# EasyEDA schematic SCH_Designing a PCB(1)_2022-05-29.json
TITLE: PWM PCB; REV: 1.0; Date: 2022-05-29; Sheet: 1/1; Company: Deakin university
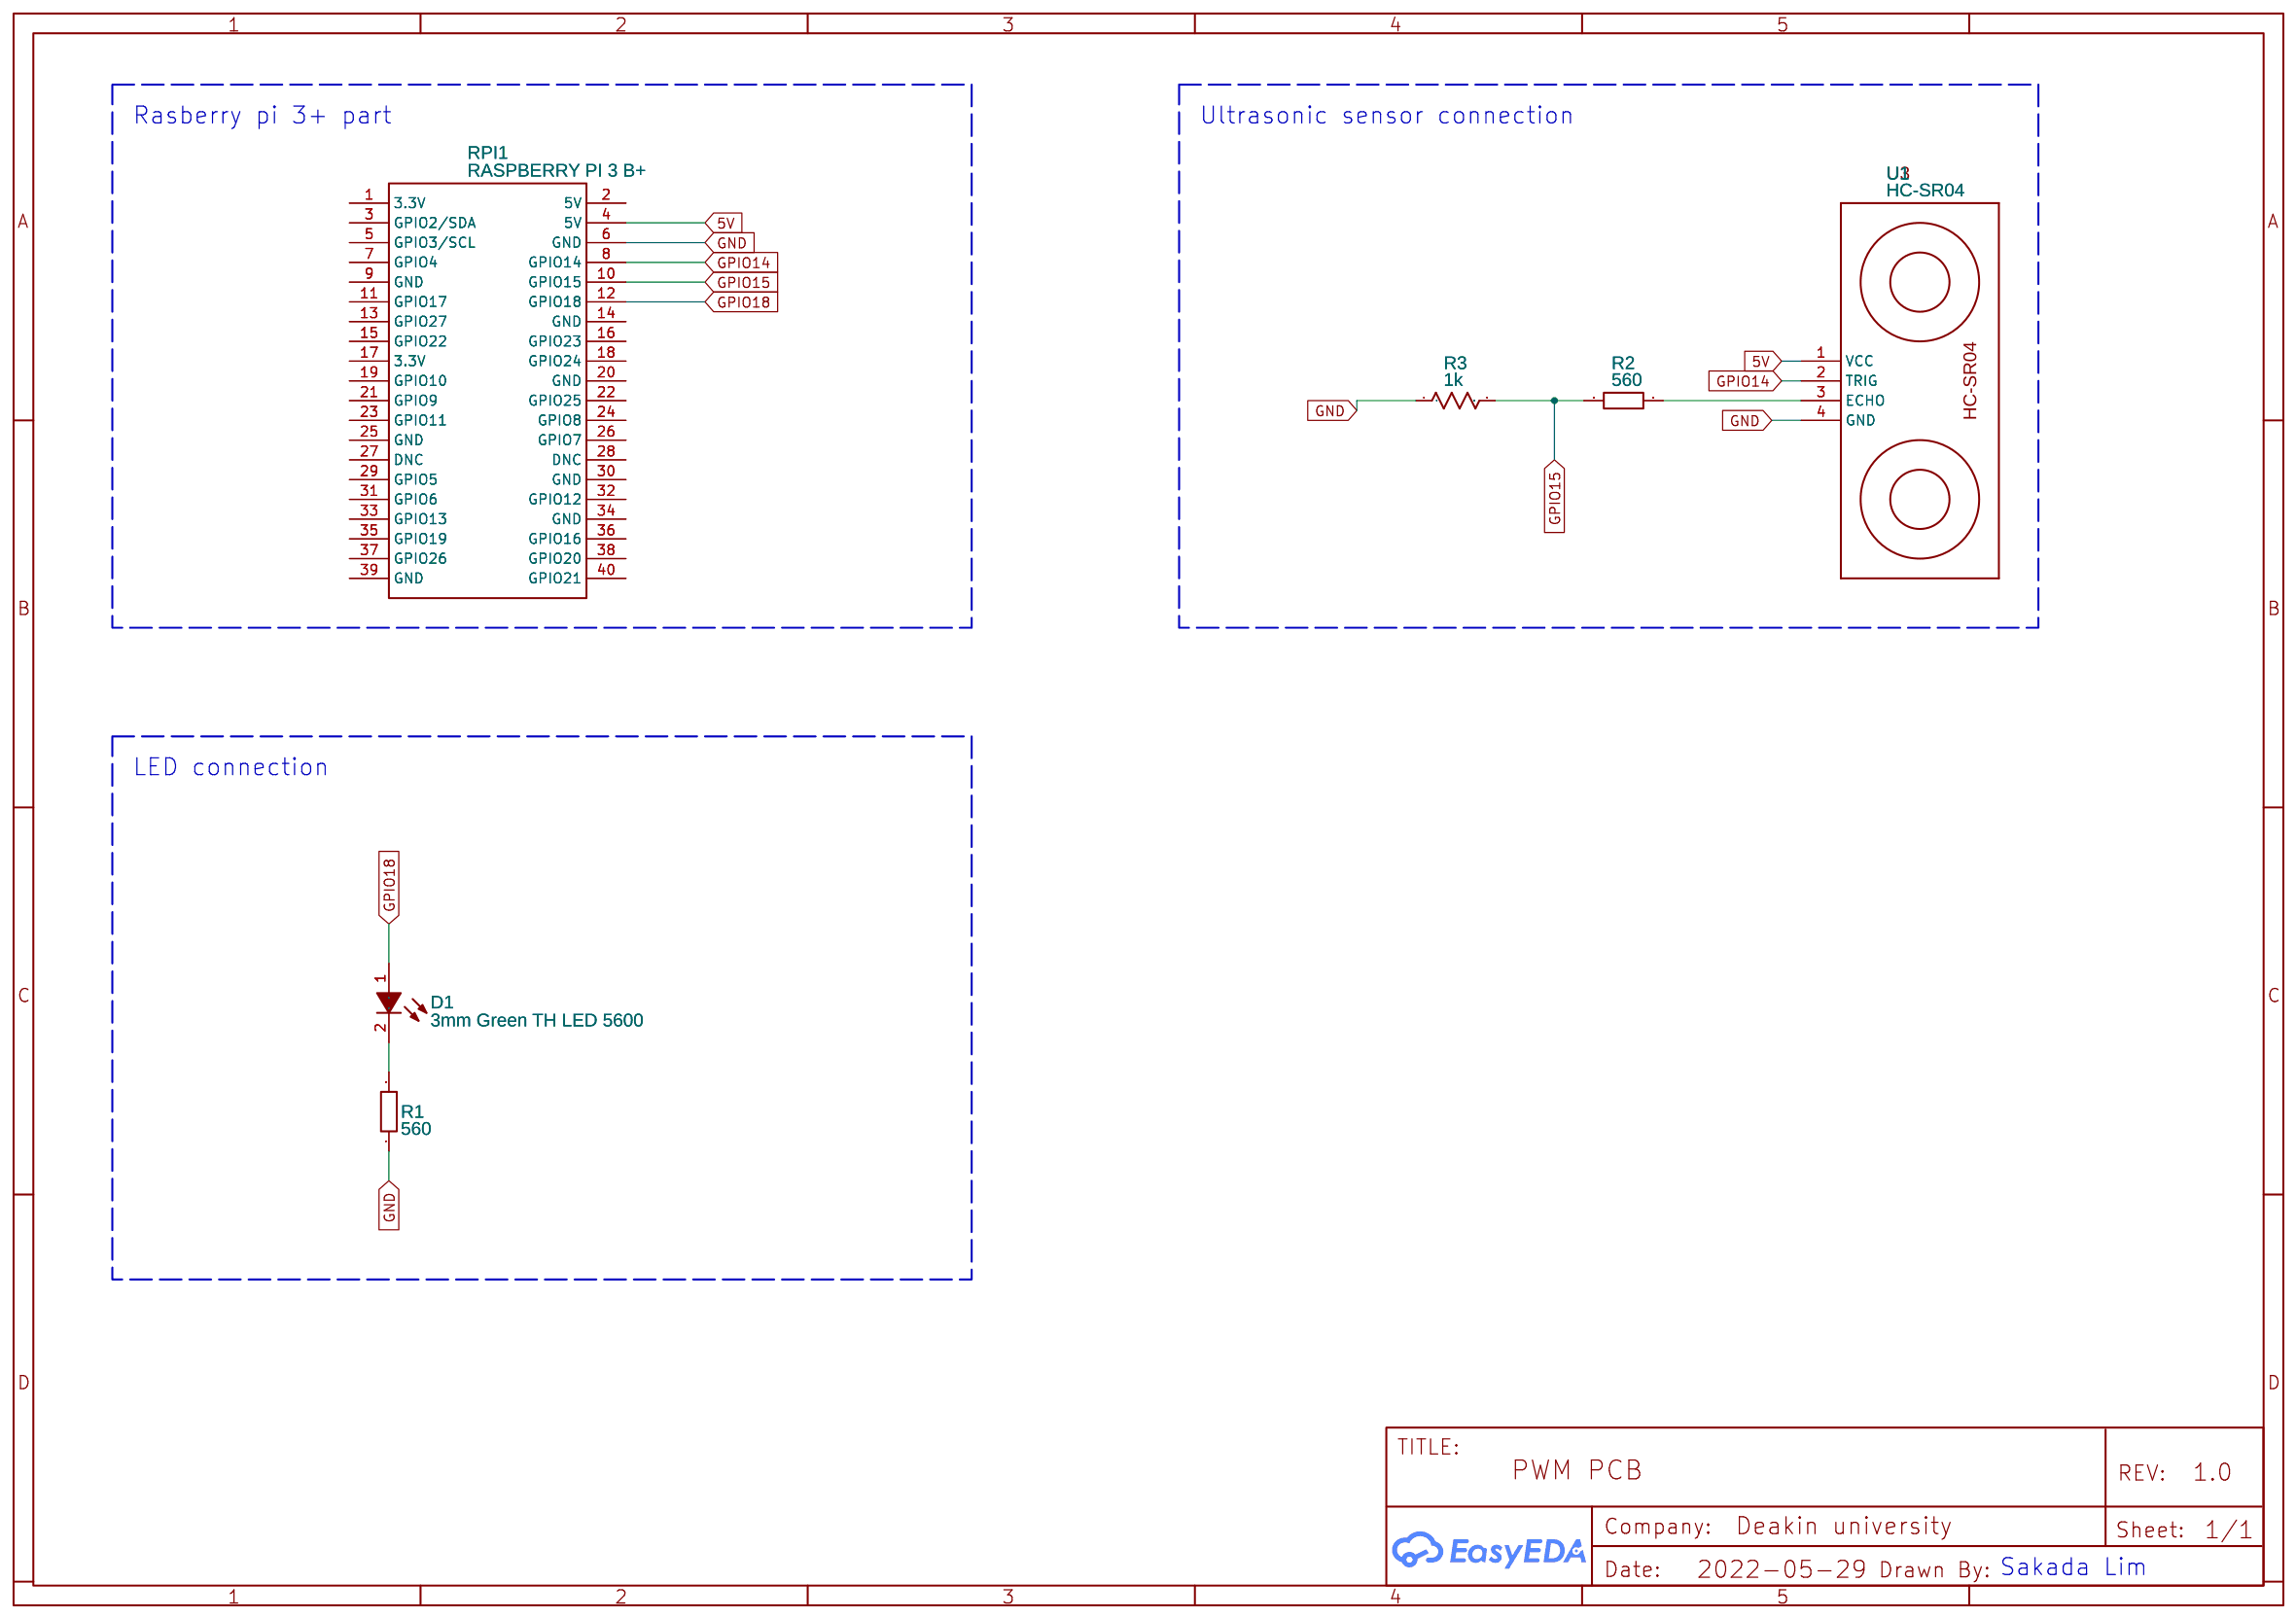
[diagram p0: schematic sheet]

## Parts
D1  3mm Green TH LED 5600  [LED-TH_LED-DP2-2LED]
R1  560  [RESISTOR 1/4 WATT 560 OHM]
R2  560  [RESISTOR 1/4 WATT 560 OHM]
R3  1k  [PKG-0.25W RESISTOR]
RPI1  RASPBERRY PI 3 B+  [HDR-20X2/2.54]
U1  HC-SR04  [HC-SR04]

## Library data of the parts
D1 = 3mm Green TH LED 5600: Supplier: Digi-Key; Manufacturer: VccLite; Manufacturer Part: 5600; Supplier Part: L20325-ND; link: https://vcclite.com/product/5602f5-5v/; Contributor: ATE
R1 R2 = 560: Contributor: Hendriyana
R3 = 1k: Power: 1/4W; Tolerance: ±5%; Supplier Part: 9339051; Supplier: Element14; Manufacturer: MULTICOMP; Manufacturer Part: MCF 0.25W 10K; Link: http://www.farnell.com/datasheets/1716725.pdf?_ga=2.90317594.160514692.1507047083-238689616.1505921947&_gac=1.171691668.1506872032.EAIaIQobChMItau139_P1gIVBZ8bCh15DgKNEAAYASAAEgK60PD_BwE; Contributor: Prof. Ing. F. Scordino
RPI1 = RASPBERRY PI 3 B+: Contributor: Sases; Supplier: Adafruit; Manufacturer: Raspberry Pi; Supplier Part: 3775; Manufacturer Part: Raspberry Pi 3 - Model B+ - 1.4GHz Cortex-A53 with 1GB RAM
U1 = HC-SR04: Manufacturer Part: ServoMotor; Contributor: srimbey

## Nets
5V: RPI1.4(5V) U1.1(VCC)
GND: R1.1 R3.1 RPI1.6(GND) U1.4(GND)
GPIO14: RPI1.8(GPIO14) U1.2(TRIG)
GPIO15: R2.1 R3.2 RPI1.10(GPIO15)
GPIO18: D1.1(A) RPI1.12(GPIO18)
Net-(D1-2): D1.2(K) R1.2
Net-(R2-2): R2.2 U1.3(ECHO)

Not connected (* = marked no-connect by the designer): RPI1 1(3.3V) 2(5V) 3(GPIO2/SDA) 5(GPIO3/SCL) 7(GPIO4) 9(GND) 11(GPIO17) 13(GPIO27) 14(GND) 15(GPIO22) 16(GPIO23) 17(3.3V) 18(GPIO24) 19(GPIO10) 20(GND) 21(GPIO9) 22(GPIO25) 23(GPIO11) 24(GPIO8) 25(GND) 26(GPIO7) 27(DNC) 28(DNC) 29(GPIO5) 30(GND) 31(GPIO6) 32(GPIO12) 33(GPIO13) 34(GND) 35(GPIO19) 36(GPIO16) 37(GPIO26) 38(GPIO20) 39(GND) 40(GPIO21)

## Notes on the sheet
- Rasberry pi 3+ part
- Ultrasonic sensor connection
- LED connection
- Sakada Lim
